# Altium schematic sheet Power_Embedded_Board_Top.SchDoc
size A; SheetNumber: 1; SheetTotal: 9
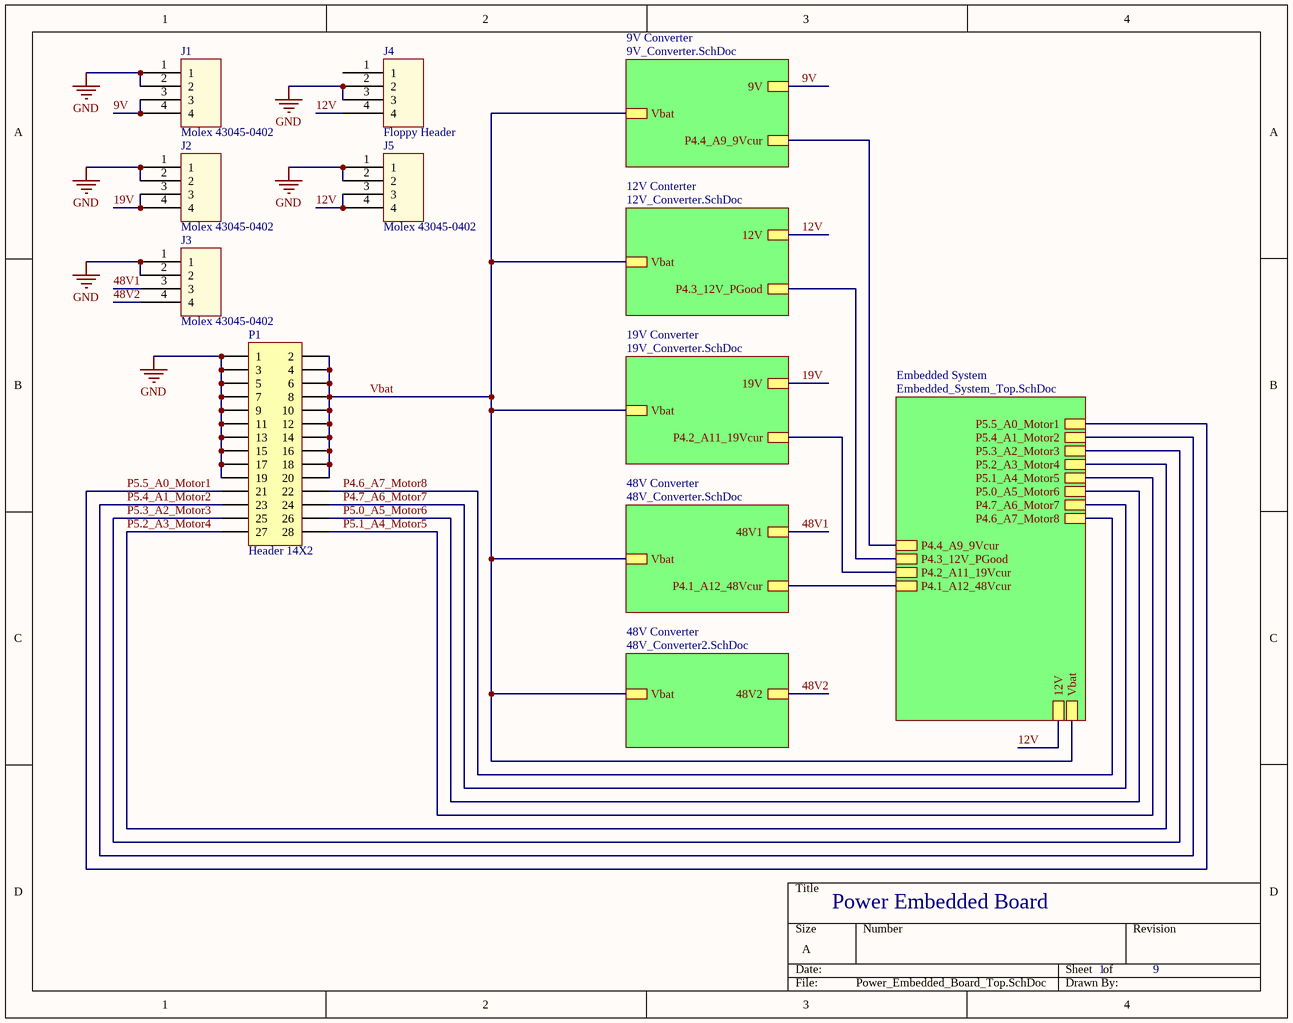
[diagram p0: Power_Embedded_Board_Top.SchDoc]

## Parts
J1  Molex 43045-0402  [Molex43045-0402]
J2  Molex 43045-0402  [Molex43045-0402]
J3  Molex 43045-0402  [Molex43045-0402]
J4  Floppy Header  [Header 1x4 12V]
J5  Molex 43045-0402  [Molex43045-0402]
P1  Header 14X2  [Header 2x14]

## Sub-sheets
9V Converter = 9V_Converter.SchDoc: Vbat, 9V, P4.4_A9_9Vcur
12V Conterter = 12V_Converter.SchDoc: Vbat, 12V, P4.3_12V_PGood
19V Converter = 19V_Converter.SchDoc: Vbat, 19V, P4.2_A11_19Vcur
48V Converter = 48V_Converter.SchDoc: Vbat, 48V1, P4.1_A12_48Vcur
48V Converter = 48V_Converter2.SchDoc: Vbat, 48V2
Embedded System = Embedded_System_Top.SchDoc: P5.5_A0_Motor1, P5.4_A1_Motor2, P5.3_A2_Motor3, P5.2_A3_Motor4, P5.1_A4_Motor5, P5.0_A5_Motor6, P4.7_A6_Motor7, P4.6_A7_Motor8, Vbat, 12V, P4.4_A9_9Vcur, P4.3_12V_PGood, P4.2_A11_19Vcur, P4.1_A12_48Vcur

## Nets
GND: J1.1 J1.2 J2.1 J2.2 J3.1 J3.2 J4.2 J4.3 J5.1 J5.2 P1.1 P1.3 P1.5 P1.7 P1.9 P1.11 P1.13 P1.15 P1.17 P1.19
9V: J1.3 J1.4 ; sheet 9V Converter/9V
12V: J4.4 J5.3 J5.4 ; sheet 12V Conterter/12V, sheet Embedded System/12V
19V: J2.3 J2.4 ; sheet 19V Converter/19V
48V1: J3.3 ; sheet 48V Converter/48V1
48V2: J3.4 ; sheet 48V Converter/48V2
P4.6_A7_Motor8: P1.22 ; sheet Embedded System/P4.6_A7_Motor8
P4.7_A6_Motor7: P1.24 ; sheet Embedded System/P4.7_A6_Motor7
P5.0_A5_Motor6: P1.26 ; sheet Embedded System/P5.0_A5_Motor6
P5.1_A4_Motor5: P1.28 ; sheet Embedded System/P5.1_A4_Motor5
P5.2_A3_Motor4: P1.27 ; sheet Embedded System/P5.2_A3_Motor4
P5.3_A2_Motor3: P1.25 ; sheet Embedded System/P5.3_A2_Motor3
P5.4_A1_Motor2: P1.23 ; sheet Embedded System/P5.4_A1_Motor2
P5.5_A0_Motor1: P1.21 ; sheet Embedded System/P5.5_A0_Motor1
Vbat: P1.2 P1.4 P1.6 P1.8 P1.10 P1.12 P1.14 P1.16 P1.18 P1.20 ; sheet 9V Converter/Vbat, sheet 12V Conterter/Vbat, sheet 19V Converter/Vbat, sheet 48V Converter/Vbat, sheet Embedded System/Vbat, sheet 48V Converter/Vbat
(unnamed): sheet 9V Converter/P4.4_A9_9Vcur, sheet Embedded System/P4.4_A9_9Vcur
(unnamed): sheet 12V Conterter/P4.3_12V_PGood, sheet Embedded System/P4.3_12V_PGood
(unnamed): sheet 19V Converter/P4.2_A11_19Vcur, sheet Embedded System/P4.2_A11_19Vcur
(unnamed): sheet 48V Converter/P4.1_A12_48Vcur, sheet Embedded System/P4.1_A12_48Vcur

Not connected (* = marked no-connect by the designer): J4 1

## Notes on the sheet
- Power Embedded Board

## Library data of the parts
J1-J5 = Molex43045-0402: Micro-Fit 3.0 Right Angle Header, 3.00mm Pitch, Dual Row, 4 Circuits, with Snap-in Plastic Peg PCB Lock, Gold, Glow Wire Capable, Black; ComponentLink1Description: Molex Website; ComponentLink1URL: https://www.molex.com/molex/products/datasheet.jsp?part=active/0430450402_PCB_HEADERS.xml
P1 = Header 14X2: Header, 14-Pin, Dual row; LatestRevisionDate: 17-Jul-2002; LatestRevisionNote: Re-released for DXP Platform.; Publisher: Altium Limited